# Altium schematic sheet TConsoleWindow.SchDoc
size A3; Organization: Altium Limited; Address1: L3, 12a Rodborough Rd; Address2: Frenchs Forest; Address3: NSW; Address4: Australia 2086; DocumentNumber: 5; SheetNumber: 5; SheetTotal: 7
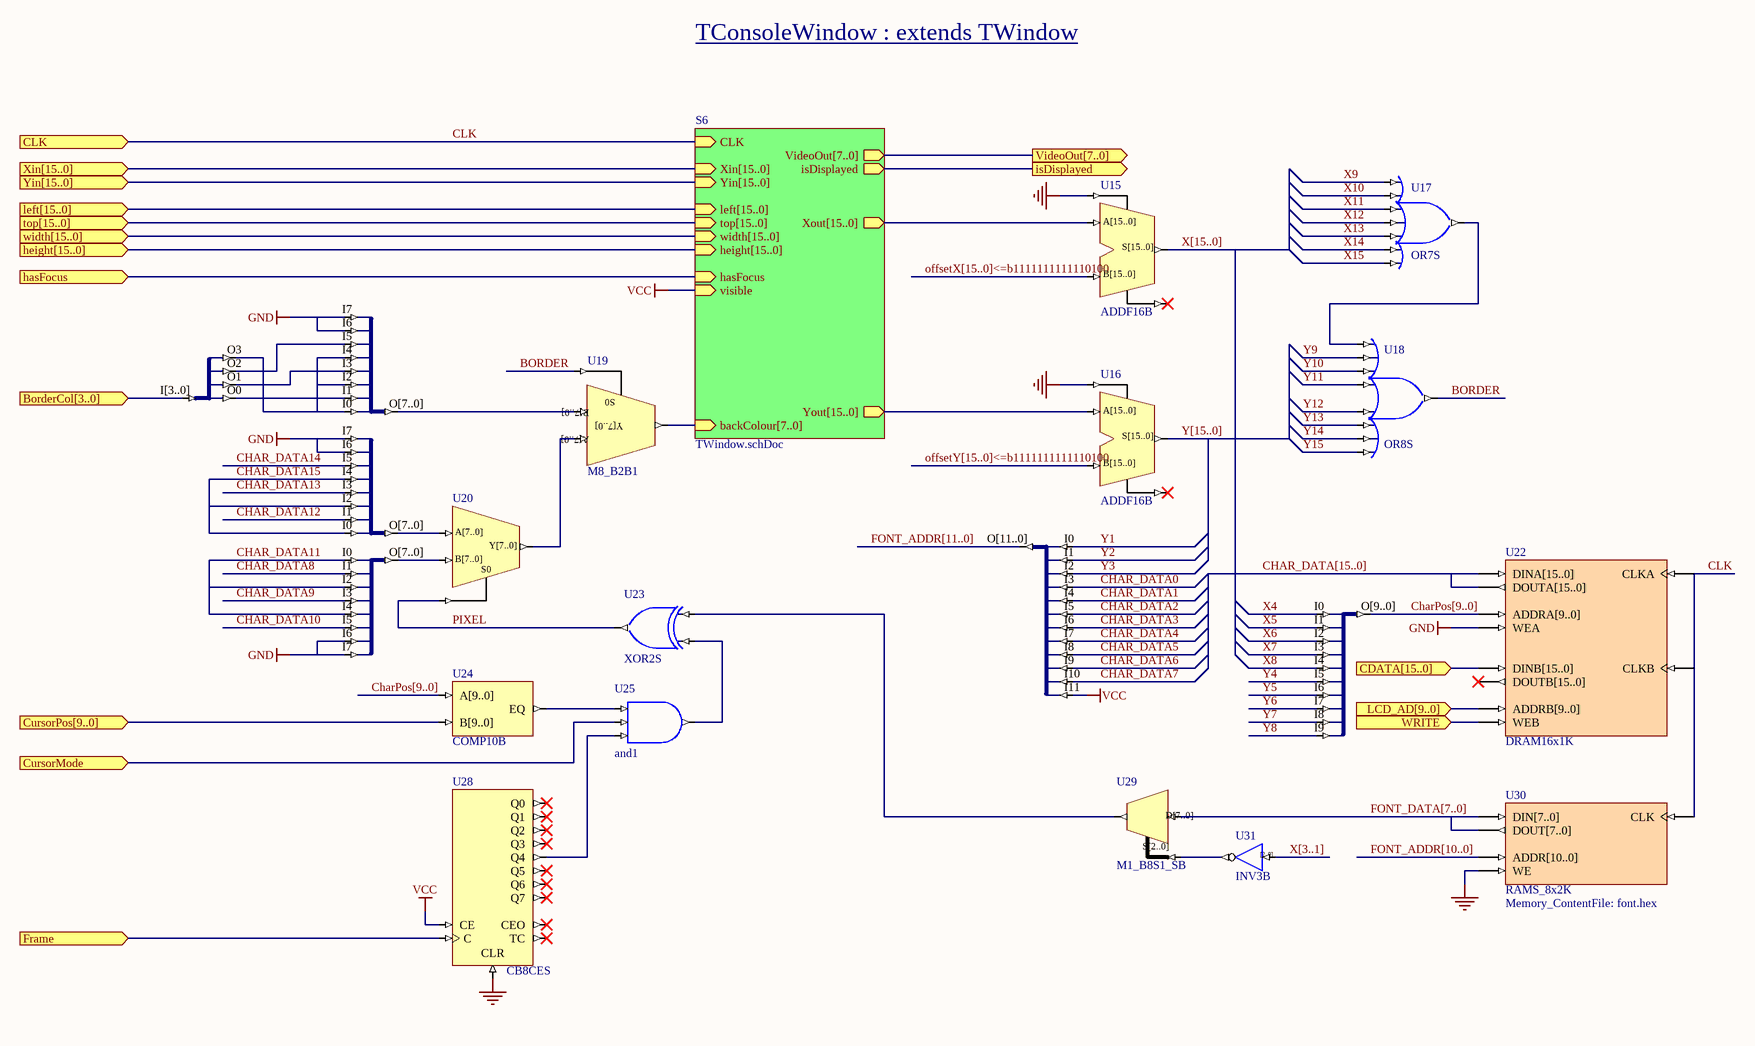
[diagram p0: TConsoleWindow.SchDoc]

## Parts
U12  J8S_8B  (value not drawn)
U13  J8S_8B  (value not drawn)
U14  J8S_8B  (value not drawn)
U15  ADDF16B
U16  ADDF16B
U17  OR7S
U18  OR8S
U19  M8_B2B1
U20  M8_B2B1  (value not drawn)
U21  J4B_4S  (value not drawn)
U22  DRAM16x1K
U23  XOR2S
U24  COMP10B
U25  and1
U26  J12S_12B  (value not drawn)
U27  J10S_10B  (value not drawn)
U28  CB8CES
U29  M1_B8S1_SB
U30  RAMS_8x2K  Memory_ContentFile: font.hex
U31  INV3B

## Sub-sheets
S6 = TWindow.schDoc: CLK (in), VideoOut[7..0] (out), Xin[15..0] (in), Yin[15..0] (in), top[15..0] (in), width[15..0] (in), height[15..0] (in), left[15..0] (in), Xout[15..0] (out), Yout[15..0] (out), backColour[7..0] (in), isDisplayed (out), visible (in), hasFocus (in)

## Ports
BorderCol[3..0] (in), CDATA[15..0] (in), CLK (in), CursorMode (in), CursorPos[9..0] (in), Frame (in), hasFocus (in), height[15..0] (in), isDisplayed (out), LCD_AD[9..0] (in), left[15..0] (in), top[15..0] (in), VideoOut[7..0] (out), width[15..0] (in), WRITE (in), Xin[15..0] (in), Yin[15..0] (in)

## Nets
GND: U12.I6 U12.I7 U13.I6 U13.I7 U14.I6 U14.I7 U15.CI U16.CI U22.WEA U28.CLR U30.WE
VCC: U26.I11 U28.CE ; sheet S6/visible
BORDER: U18.O U19.S0
BorderCol[3..0]: U21.I[3..0] ; port BorderCol[3..0]
CDATA[15..0]: U22.DINB[15..0] ; port CDATA[15..0]
CHAR_DATA0: U26.I3
CHAR_DATA1: U26.I4
CHAR_DATA2: U26.I5
CHAR_DATA3: U26.I6
CHAR_DATA4: U26.I7
CHAR_DATA5: U26.I8
CHAR_DATA6: U26.I9
CHAR_DATA7: U26.I10
CHAR_DATA8: U14.I1
CHAR_DATA9: U14.I3
CHAR_DATA10: U14.I5
CHAR_DATA11: U14.I0 U14.I2 U14.I4
CHAR_DATA12: U13.I1
CHAR_DATA13: U13.I3
CHAR_DATA14: U13.I5
CHAR_DATA15: U13.I0 U13.I2 U13.I4
CHAR_DATA[15..0]: U22.DINA[15..0] U22.DOUTA[15..0]
CharPos[9..0]: U22.ADDRA[9..0] U24.A[9..0] U27.O[9..0]
CLK: U22.CLKA U22.CLKB U30.CLK ; port CLK, sheet S6/CLK
CursorMode: U25.I1 ; port CursorMode
CursorPos[9..0]: U24.B[9..0] ; port CursorPos[9..0]
FONT_ADDR[10..0]: U30.ADDR[10..0]
FONT_ADDR[11..0]: U26.O[11..0]
FONT_DATA[7..0]: U29.D[7..0] U30.DIN[7..0] U30.DOUT[7..0]
Frame: U28.C ; port Frame
hasFocus: port hasFocus, sheet S6/hasFocus
isDisplayed: port isDisplayed, sheet S6/isDisplayed
LCD_AD[9..0]: U22.ADDRB[9..0] ; port LCD_AD[9..0]
offsetX[15..0]<=b1111111111110100: U15.B[15..0]
offsetY[15..0]<=b1111111111110100: U16.B[15..0]
PIXEL: U20.S0 U23.O
WRITE: U22.WEB ; port WRITE
X4: U27.I0
X5: U27.I1
X6: U27.I2
X7: U27.I3
X8: U27.I4
X9: U17.I0
X10: U17.I1
X11: U17.I2
X12: U17.I3
X13: U17.I4
X14: U17.I5
X15: U17.I6
X[3..1]: U31.I[2..0]
X[15..0]: U15.S[15..0]
Y1: U26.I0
Y2: U26.I1
Y3: U26.I2
Y4: U27.I5
Y5: U27.I6
Y6: U27.I7
Y7: U27.I8
Y8: U27.I9
Y9: U18.I1
Y10: U18.I2
Y11: U18.I3
Y12: U18.I4
Y13: U18.I5
Y14: U18.I6
Y15: U18.I7
Y[15..0]: U16.S[15..0]
NetU12_I0: U12.I0 U12.I2 U12.I4 U21.O3
NetU12_I1: U12.I1 U21.O0
NetU12_I3: U12.I3 U21.O1
NetU12_I5: U12.I5 U21.O2
NetU12_O[7..0]: U12.O[7..0] U19.B[7..0]
NetU13_O[7..0]: U13.O[7..0] U20.A[7..0]
NetU14_O[7..0]: U14.O[7..0] U20.B[7..0]
NetU15_A[15..0]: U15.A[15..0] ; sheet S6/Xout[15..0]
NetU16_A[15..0]: U16.A[15..0] ; sheet S6/Yout[15..0]
NetU17_O: U17.O U18.I0
NetU19_A[7..0]: U19.A[7..0] U20.Y[7..0]
NetU19_Y[7..0]: U19.Y[7..0] ; sheet S6/backColour[7..0]
NetU23_I0: U23.I0 U29.O
NetU23_I1: U23.I1 U25.O
NetU24_EQ: U24.EQ U25.I0
NetU25_I2: U25.I2 U28.Q4
NetU29_S[2..0]: U29.S[2..0] U31.O[2..0]

Not connected (* = marked no-connect by the designer): U15 CO*; U16 CO*; U22 DOUTB[15..0]*; U28 CEO* Q0* Q1* Q2* Q3* Q5* Q6* Q7* TC*

## Buses and harness runs
bus CHAR_DATA[15..0]
bus CharPos[9..0]
bus FONT_ADDR[10..0]
bus FONT_ADDR[11..0]
bus FONT_DATA[7..0]
bus offsetX[15..0]<=b1111111111110100
bus offsetY[15..0]<=b1111111111110100
bus port height[15..0] = sheet S6/height[15..0]
bus port left[15..0] = sheet S6/left[15..0]
bus port top[15..0] = sheet S6/top[15..0]
bus port VideoOut[7..0] = sheet S6/VideoOut[7..0]
bus port width[15..0] = sheet S6/width[15..0]
bus port Xin[15..0] = sheet S6/Xin[15..0]
bus port Yin[15..0] = sheet S6/Yin[15..0]
bus X[3..1]
bus X[15..0]
bus Y[15..0]

## Notes on the sheet
- TConsoleWindow : extends TWindow
- Title
- Size:
- Date:
- A3
- Number:
- Time:
- Revision:
- Sheet
- of
- File:
- (in symbol INV3B) [2..0]

## Library data of the parts
U12-U14 = J8S_8B: 8 Single pin inputs to single 8-Bit output bus; ArchiveName: GENERIC; VHDLIB_SIM: GENERIC_LIB; Published: 29-Jan-2004; Publisher: Altium Limited; Core Revision: 1.00.00
U15 U16 = ADDF16B: 16-Bit Cascadable Unsigned Binary Full Adder, Bus Version; ArchiveName: GENERIC; VHDLIB_SIM: GENERIC_LIB; Published: 31-May-2004; Publisher: Altium Limited; Core Revision: 1.00.00
U17 = OR7S: 7-Input OR Gate, Single Pin Version; Xilinx Equivalent: OR7; ArchiveName: GENERIC; VHDLIB_SIM: GENERIC_LIB; Published: 29-Jan-2004; Publisher: Altium Limited; Core Revision: 1.00.00
U18 = OR8S: 8-Input OR Gate, Single Pin Version; ArchiveName: GENERIC; VHDLIB_SIM: GENERIC_LIB; Xilinx Equivalent: OR8; Published: 29-Jan-2004; Publisher: Altium Limited; Core Revision: 1.00.00
U19 U20 = M8_B2B1: 2x8-Bit Bus to 1x8-Bit Bus Multiplexer; ArchiveName: GENERIC; VHDLIB_SIM: GENERIC_LIB; Published: 29-Jan-2004; Publisher: Altium Limited; Core Revision: 1.00.00
U21 = J4B_4S: 4-Bit input bus to 4 Single pin outputs; ArchiveName: GENERIC; VHDLIB_SIM: GENERIC_LIB; Published: 29-Jan-2004; Publisher: Altium Limited; Core Revision: 1.00.00
U22 = RAMD_16x1K: Dual Port RAM; Memory_DepthA: 1024; Memory_Type: RAM_DualPortBlock; Memory_WidthA: 16; Memory_ClockEdge: Rising; Nexus_Core: Memory_Program; Memory_EnablePin: False; Published: 23/04/2004; Publisher: Altium Hobart Technology Center; Memory_DepthB: 1024; Memory_WidthB: 16
U23 = XOR2S: 2-Input Exclusive-OR Gate, Single Pin Version; ArchiveName: GENERIC; VHDLIB_SIM: GENERIC_LIB; Xilinx Equivalent: XOR2; Published: 29-Jan-2004; Publisher: Altium Limited; Core Revision: 1.00.00
U24 = COMP10B: 10-Bit Identity Comparator, Bus Version; ArchiveName: GENERIC; VHDLIB_SIM: GENERIC_LIB; Published: 29-Jan-2004; Publisher: Altium Limited; Core Revision: 1.00.00
U25 = AND3S: 3-Input AND Gate, Single Pin Version; ArchiveName: GENERIC; VHDLIB_SIM: GENERIC_LIB; Xilinx Equivalent: AND3; Published: 29-Jan-2004; Publisher: Altium Limited; Core Revision: 1.00.00
U26 = J12S_12B: 12 Single pin inputs to single 12-Bit output bus; ArchiveName: GENERIC; VHDLIB_SIM: GENERIC_LIB; Published: 29-Jan-2004; Publisher: Altium Limited; Core Revision: 1.00.00
U27 = J10S_10B: 10 Single pin inputs to single 10-Bit output bus; ArchiveName: GENERIC; VHDLIB_SIM: GENERIC_LIB; Published: 29-Jan-2004; Publisher: Altium Limited; Core Revision: 1.00.00
U28 = CB8CES: 8-Bit Cascadable Binary Counters with Clock Enable and Asynchronous Clear, Single Pin Version; ArchiveName: GENERIC; VHDLIB_SIM: GENERIC_LIB; Published: 29-Jan-2004; Publisher: Altium Limited; Core Revision: 1.00.00
U29 = M1_B8S1_SB: 1x8-Bit Bus to 1x1-Single Wire Multiplexer With Bus Version Select; ArchiveName: GENERIC; VHDLIB_SIM: GENERIC_LIB; Published: 31-May-2004; Publisher: Altium Limited; Core Revision: 1.00.00
U30 = RAMS_8x2K: Single Port RAM; Memory_Type: RAM_SinglePortBlock; Memory_ClockEdge: Rising; Nexus_Core: Memory_Program; Memory_Depth: 2048; Memory_Width: 8; Memory_EnablePin: False; Published: 23/04/2004; Publisher: Altium Hobart Technology Center
U31 = INV3B: 3-Bit Inverter, Bus Version; ArchiveName: GENERIC; VHDLIB_SIM: GENERIC_LIB; Published: 29-Jan-2004; Publisher: Altium Limited; Core Revision: 1.00.00